# Altium schematic sheet TU_MAIN.SchDoc
size 1651 x 1651 mm
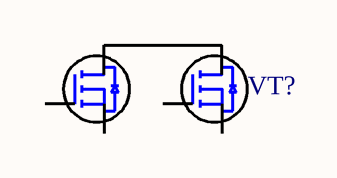
[diagram p0: TU_MAIN.SchDoc]

## Parts
VT?  8205A  [SOT-23-6]  (value not drawn)

## Nets

Not connected (* = marked no-connect by the designer): VT? 1 2 3 4 5 6

## Library data of the parts
VT? = 8205A: MOSFET N-CHANNEL 20V 5A; pin to pad: 2>2+5 5>2+5; Manufacturer: UMW; Datasheet: https://static.chipdip.ru/lib/303/DOC021303523.pdf; HelpURL: https://www.chipdip.by/product/8205a; Package/Case: SOT-23-6; Product Category: MOSFET